# EAGLE design sew_pads (EAGLE 7.5.0)
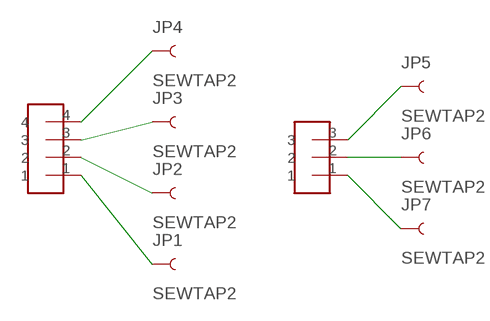
[diagram p0: schematic, sheet 1]

## Parts
JP1  SEWTAP2  [PETAL-LONG-2]
JP2  SEWTAP2  [PETAL-LONG-2]
JP3  SEWTAP2  [PETAL-LONG-2]
JP4  SEWTAP2  [PETAL-LONG-2]
JP5  SEWTAP2  [PETAL-LONG-2]
JP6  SEWTAP2  [PETAL-LONG-2]
JP7  SEWTAP2  [PETAL-LONG-2]
U$1  HEADER-3  [HEADER-3]
U$2  HEADER-4  [HEADER-4]

## Nets
N$1: JP4.1 U$2.4
N$2: JP3.1 U$2.3
N$3: JP2.1 U$2.2
N$4: JP1.1 U$2.1
N$5: JP5.1 U$1.3
N$6: JP6.1 U$1.2
N$7: JP7.1 U$1.1

## Library data of the parts
JP1-JP7 = LilyPad-Wearables:SEWTAP: Sew Taps for LilyPad Boards.
U$1 = homemade-hardware:HEADER-3
U$2 = homemade-hardware:HEADER-4

## Board
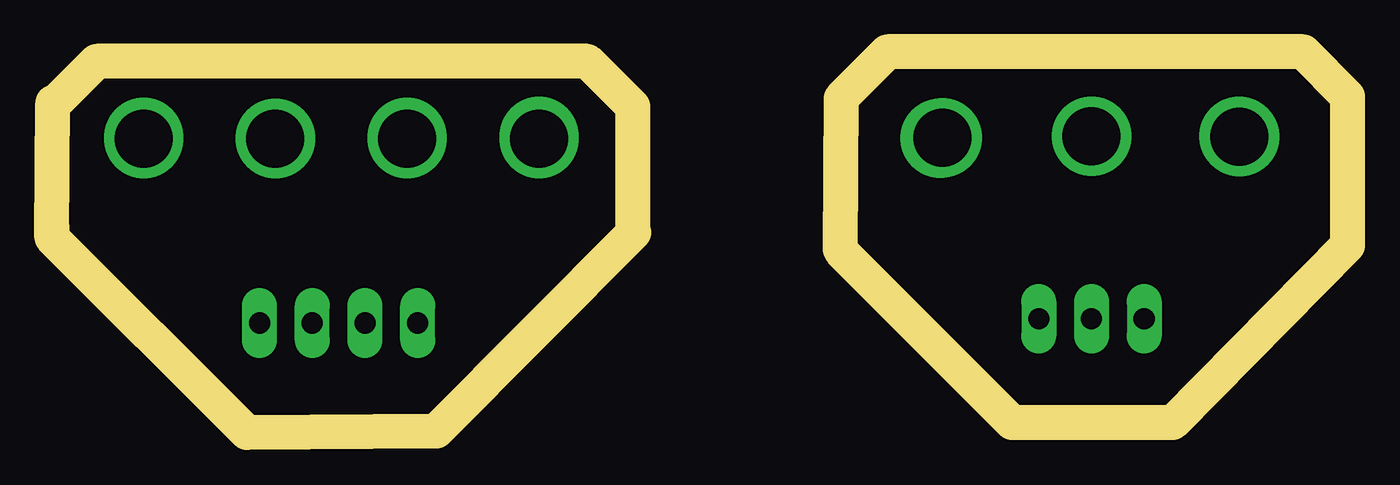
[diagram p1: board, top side]
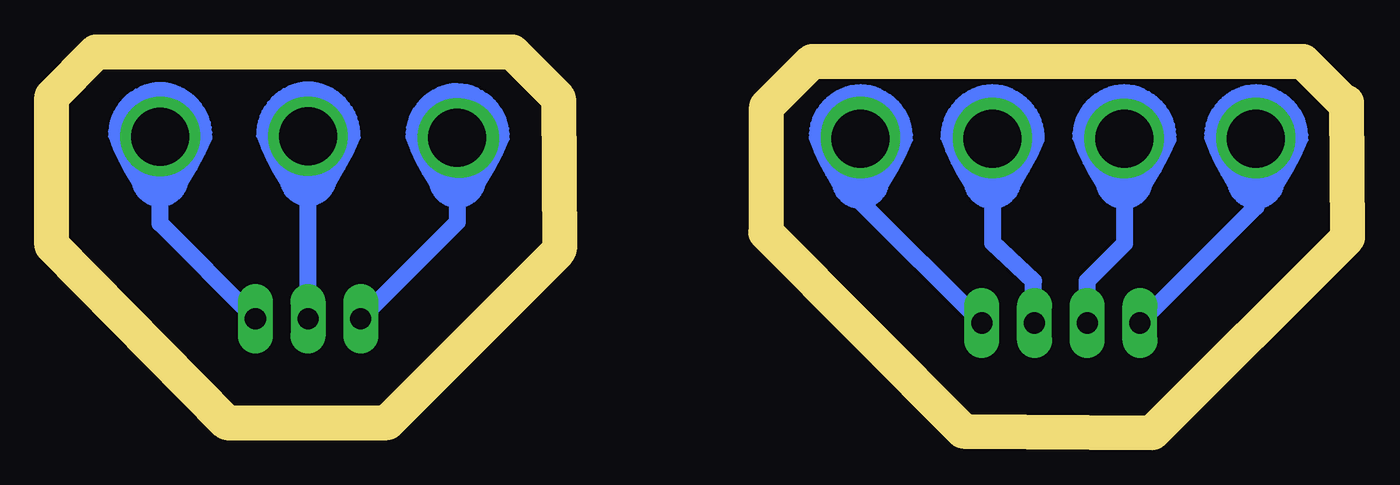
[diagram p2: board, bottom side, seen from below]

Size 62.43 x 18.34 mm. Coordinates in mm from the lower left corner, seen from the top.
Outline: 0,9.47 0.05,15.9
Outline: 27.99,9.63 27.99,15.7 25.81,17.88 2.16,17.88 0.05,15.77
Outline: 37.97,8.84 38.02,16.1 40.26,18.34 60.3,18.34 62.43,16.18 62.43,9.02 54,0.48 46.28,0.48 38.02,8.74
Outline: 28.04,9.65 18.52,0.08 9.4,0 0,9.4 0,9.47
Outline: 0,9.47 0,9.88
Copper layers (1*16): Top 0.035mm / dielectric 1.5mm / Bottom 0.035mm
Design rules "default": minimum track width 10mil, minimum drill 24mil, track to track 8mil, track to pad 8mil, pad to pad 8mil, via to via 8mil, smd to smd 8mil, copper to edge 40mil, drill to drill 8mil, minimum pad ring 10mil, minimum via ring 8mil, stop-mask expansion 4mil, vias tented up to drill 0mil, thermal gap 10mil

### Footprints (pad centres in the part's own frame; a part is rotated, then mirrored left to right if it is on the bottom)
PETAL-LONG-2 = drill 2.794: 1 0,0
HEADER-3 = drill 1.016 pad 1.676 long: 1 0,0; 2 0,2.54; 3 0,5.08
HEADER-4 = drill 1.016 pad 1.676 long: 1 0,0; 2 0,2.54; 3 0,5.08; 4 0,7.62

### Placement (x,y rotation side)
JP1  23.47,14.15 180 bottom
JP2  17.12,14.15 180 bottom
JP3  10.77,14.15 180 bottom
JP4  4.42,14.15 180 bottom
JP5  57.23,14.25 180 bottom
JP6  50.09,14.27 180 bottom
JP7  42.9,14.2 180 bottom
U$1  47.55,5.49 270 top
U$2  17.63,5.28 90 top

### Tracks (layer width: path | path; a pad name or v marks a point on that pad's centre or on a via)
N$1  (via drill 1.5 pad 3.81)
  Top 0.813: JP4.1 v4.42,14.22
  Bottom 0.813: JP4.1 4.42,10.87 U$2.4
N$2  (via drill 1.5 pad 3.81)
  Top 0.813: v10.77,14.17 JP3.1
  Bottom 0.813: U$2.3 12.55,7.32 10.74,9.12 10.74,14.15 v10.77,14.17
N$3  (via drill 1.5 pad 3.81)
  Top 0.813: JP2.1 v17.12,14.22
  Bottom 0.813: 17.17,14.17 v17.12,14.22 17.09,9.14 15.14,7.32 U$2.2
N$4  (via drill 1.5 pad 3.81)
  Top 0.813: v23.47,14.27 JP1.1
  Bottom 0.813: U$2.1 23.47,11.12 v23.47,14.27
N$5
  Bottom 0.813: U$1.3 57.23,10.08 JP5.1
N$6
  Bottom 0.813: U$1.2 JP6.1
N$7
  Bottom 0.813: JP7.1 42.9,10.14 U$1.1
N$8  (via drill 1.2 pad 3.81)
  other vias: 42.8,14.17
N$9  (via drill 1.2 pad 3.81)
  other vias: 50.11,14.27
N$10  (via drill 1.2 pad 3.81)
  other vias: 57.2,14.27